# Altium schematic sheet Connectors.SchDoc: External Connectors
size A4; Author: Andrea P; Organization: Waterloop; Address1: 200 University Ave W; Address2: Engineering 5, 1104; Address3: Waterloo, ON; Address4: N2L 3G1; Revision: B; SheetNumber: 4; SheetTotal: 4
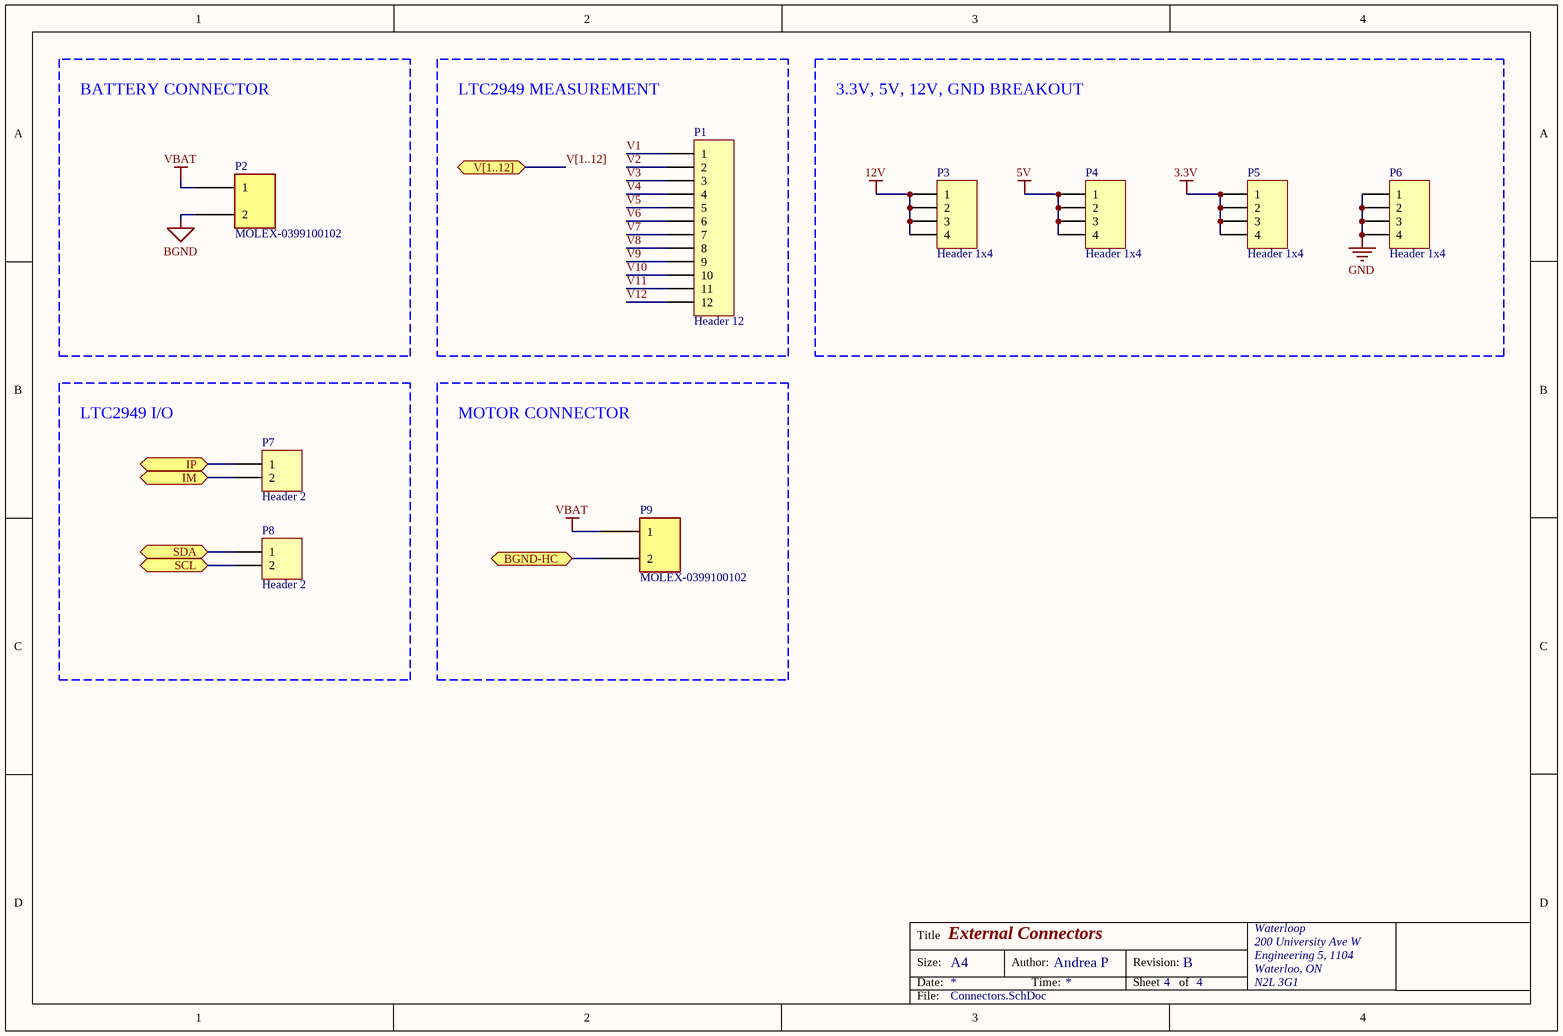
[diagram p0: Connectors.SchDoc]

## Parts
P1  Header 12  [HDR1X12]
P2  MOLEX-0399100102  [PHOENIX-1017531]
P3  Header 1x4  [HDR1X4]
P4  Header 1x4  [HDR1X4]
P5  Header 1x4  [HDR1X4]
P6  Header 1x4  [HDR1X4]
P7  Header 2  [HDR1X2]
P8  Header 2  [HDR1X2]
P9  MOLEX-0399100102  [PHOENIX-1017531]

## Blocks framed on the sheet
BATTERY CONNECTOR: P2
LTC2949 MEASUREMENT: P1
3.3V, 5V, 12V, GND BREAKOUT: P3-P6
LTC2949 I/O: P7 P8
MOTOR CONNECTOR: P9

## Ports
BGND-HC (bidir), IM (bidir), IP (bidir), SCL (bidir), SDA (bidir), V[1..12] (bidir)

## Nets
3.3V: P5.1 P5.2 P5.3 P5.4
5V: P4.1 P4.2 P4.3 P4.4
12V: P3.1 P3.2 P3.3 P3.4
BGND: P2.2
GND: P6.1 P6.2 P6.3 P6.4
VBAT: P2.1 P9.1
BGND-HC: P9.2 ; port BGND-HC
IM: P7.2 ; port IM
IP: P7.1 ; port IP
SCL: P8.2 ; port SCL
SDA: P8.1 ; port SDA
V1: P1.1
V2: P1.2
V3: P1.3
V4: P1.4
V5: P1.5
V6: P1.6
V7: P1.7
V8: P1.8
V9: P1.9
V10: P1.10
V11: P1.11
V12: P1.12

## Buses and harness runs
bus V[1..12] = port V[1..12]

## Notes on the sheet
- Title
- Size:
- Date:
- A4
- Author:
- Time:
- Revision:
- Sheet
- of
- File:

## Library data of the parts
P1 = Header 12: Header, 12-Pin; LatestRevisionDate: 17-Jul-2002; LatestRevisionNote: Re-released for DXP Platform.; Publisher: Altium Limited
P2 P9 = MOLEX-0399100102: TERM BLK 2P SIDE ENT 10.16MM PCB
P3-P6 = Header 4: Header, 4-Pin; LatestRevisionDate: 17-Jul-2002; LatestRevisionNote: Re-released for DXP Platform.; Publisher: Altium Limited
P7 P8 = Header 2: Header, 2-Pin; LatestRevisionDate: 17-Jul-2002; LatestRevisionNote: Re-released for DXP Platform.; Publisher: Altium Limited